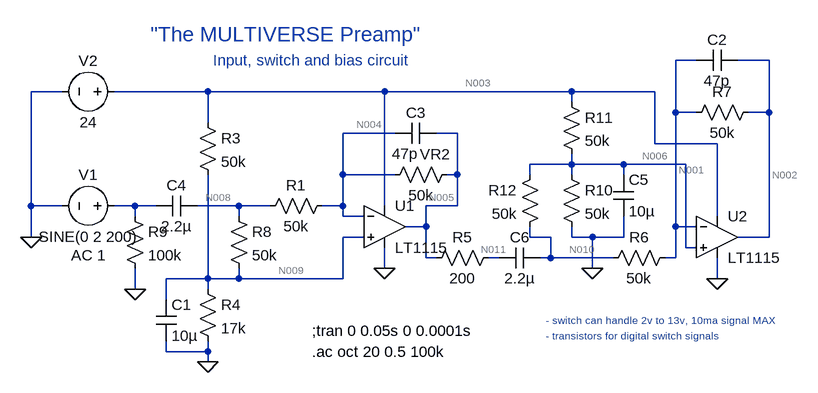
[diagram p0: schematic Input Bias Circuit.asc]
Input Bias Circuit.asc, the LTspice schematic file:
Version 4
SHEET 1 880 680
WIRE 528 -96 496 -96
WIRE 640 -96 592 -96
WIRE -448 -48 -496 -48
WIRE -224 -48 -368 -48
WIRE 48 -48 -224 -48
WIRE 336 -48 48 -48
WIRE 464 -48 336 -48
WIRE 336 -32 336 -48
WIRE 496 -16 496 -96
WIRE 528 -16 496 -16
WIRE 640 -16 640 -96
WIRE 640 -16 608 -16
WIRE -224 0 -224 -48
WIRE 64 16 -16 16
WIRE 160 16 128 16
WIRE 464 32 464 -48
WIRE 560 32 464 32
WIRE 336 64 336 48
WIRE 336 64 272 64
WIRE 416 64 336 64
WIRE 512 64 416 64
WIRE -16 80 -16 16
WIRE 64 80 -16 80
WIRE 160 80 160 16
WIRE 160 80 144 80
WIRE 272 80 272 64
WIRE 336 80 336 64
WIRE 416 80 416 64
WIRE -496 128 -496 -48
WIRE -448 128 -496 128
WIRE -336 128 -368 128
WIRE -304 128 -336 128
WIRE -176 128 -240 128
WIRE -128 128 -176 128
WIRE -16 128 -16 80
WIRE -16 128 -48 128
WIRE 48 128 48 -48
WIRE 160 128 160 80
WIRE 160 128 112 128
WIRE -336 144 -336 128
WIRE -176 144 -176 128
WIRE -16 144 -16 128
WIRE 16 144 -16 144
WIRE 560 144 560 32
WIRE 112 160 112 128
WIRE 112 160 80 160
WIRE 496 160 496 -16
WIRE 528 160 496 160
WIRE -496 176 -496 128
WIRE 16 176 -16 176
WIRE 272 176 272 160
WIRE 304 176 272 176
WIRE 336 176 336 160
WIRE 368 176 336 176
WIRE 416 176 416 144
WIRE 416 176 368 176
WIRE 640 176 640 -16
WIRE 640 176 592 176
WIRE 512 192 512 64
WIRE 528 192 512 192
WIRE 112 208 112 160
WIRE 128 208 112 208
WIRE 224 208 208 208
WIRE 304 208 304 176
WIRE 304 208 288 208
WIRE 400 208 304 208
WIRE 496 208 496 160
WIRE 496 208 480 208
WIRE 48 224 48 192
WIRE 368 224 368 176
WIRE -224 240 -224 80
WIRE -224 240 -288 240
WIRE -176 240 -176 224
WIRE -176 240 -224 240
WIRE -16 240 -16 176
WIRE -16 240 -176 240
WIRE 560 240 560 208
WIRE -336 256 -336 224
WIRE -224 256 -224 240
WIRE -288 272 -288 240
WIRE -288 352 -288 336
WIRE -224 352 -224 336
WIRE -224 352 -288 352
WIRE -224 368 -224 352
FLAG -496 176 0
FLAG -224 368 0
FLAG 48 224 0
FLAG 560 240 0
FLAG -336 256 0
FLAG 368 224 0
SYMBOL voltage -352 128 R90
WINDOW 0 -32 56 VBottom 2
WINDOW 3 32 56 VTop 2
WINDOW 123 60 56 VTop 2
WINDOW 39 0 0 Left 2
SYMATTR InstName V1
SYMATTR Value SINE(0 2 200)
SYMATTR Value2 AC 1
SYMBOL res -32 112 R90
WINDOW 0 0 56 VBottom 2
WINDOW 3 32 56 VTop 2
SYMATTR InstName R1
SYMATTR Value 50k
SYMBOL res 160 64 R90
WINDOW 0 0 34 VBottom 2
WINDOW 3 32 56 VTop 2
SYMATTR InstName VR2
SYMATTR Value 50k
SYMBOL Opamps\\LT1115 48 96 R0
SYMATTR InstName U1
SYMBOL voltage -352 -48 R90
WINDOW 0 -32 56 VBottom 2
WINDOW 3 32 56 VTop 2
WINDOW 123 0 0 Left 2
WINDOW 39 0 0 Left 2
SYMATTR InstName V2
SYMATTR Value 24
SYMBOL res -240 -16 R0
SYMATTR InstName R3
SYMATTR Value 50k
SYMBOL res -240 240 R0
SYMATTR InstName R4
SYMATTR Value 17k
SYMBOL cap -304 272 R0
SYMATTR InstName C1
SYMATTR Value 10µ
SYMBOL res 224 192 R90
WINDOW 0 0 56 VBottom 2
WINDOW 3 32 56 VTop 2
SYMATTR InstName R5
SYMATTR Value 200
SYMBOL Opamps\\LT1115 560 112 R0
SYMATTR InstName U2
SYMBOL res 496 192 R90
WINDOW 0 0 56 VBottom 2
WINDOW 3 32 56 VTop 2
SYMATTR InstName R6
SYMATTR Value 50k
SYMBOL res 624 -32 R90
WINDOW 0 0 56 VBottom 2
WINDOW 3 32 56 VTop 2
SYMATTR InstName R7
SYMATTR Value 50k
SYMBOL cap 592 -112 R90
WINDOW 0 0 32 VBottom 2
WINDOW 3 32 32 VTop 2
SYMATTR InstName C2
SYMATTR Value 47p
SYMBOL res -192 128 R0
SYMATTR InstName R8
SYMATTR Value 50k
SYMBOL cap 128 0 R90
WINDOW 0 0 32 VBottom 2
WINDOW 3 32 48 VTop 2
SYMATTR InstName C3
SYMATTR Value 47p
SYMBOL res -352 128 R0
SYMATTR InstName R9
SYMATTR Value 100k
SYMBOL cap -304 144 R270
WINDOW 0 32 32 VTop 2
WINDOW 3 0 32 VBottom 2
SYMATTR InstName C4
SYMATTR Value 2.2µ
SYMBOL res 320 64 R0
SYMATTR InstName R10
SYMATTR Value 50k
SYMBOL res 320 -48 R0
SYMATTR InstName R11
SYMATTR Value 50k
SYMBOL cap 400 80 R0
SYMATTR InstName C5
SYMATTR Value 10µ
SYMBOL res 288 64 M0
SYMATTR InstName R12
SYMATTR Value 50k
SYMBOL cap 288 192 R90
WINDOW 0 0 32 VBottom 2
WINDOW 3 32 32 VTop 2
SYMATTR InstName C6
SYMATTR Value 2.2µ
TEXT -64 320 Left 2 !;tran 0 0.05s 0 0.0001s
TEXT 296 328 Left 1 ;- transistors for digital switch signals
TEXT 296 304 Left 1 ;- switch can handle 2v to 13v, 10ma signal MAX
TEXT -64 352 Left 2 !.ac oct 20 0.5 100k
TEXT -312 -136 Left 3 ;"The MULTIVERSE Preamp"
TEXT -216 -96 Left 2 ;Input, switch and bias circuit

The netlist it stands for:
* Input Bias Circuit.asc
V1 N007 0 SINE(0 2 200) AC 1
R1 N004 N008 50k
R§VR2 N005 N004 50k
XU1 N009 N004 N003 0 N005 LT1028  ; LT1115, pins In+ In- V+ V- OUT
V2 N003 0 24
R3 N003 N009 50k
R4 N009 0 17k
C1 N009 0 10µ
R5 N011 N005 200
XU2 N006 N001 N003 0 N002 LT1028  ; LT1115, pins In+ In- V+ V- OUT
R6 N001 N010 50k
R7 N002 N001 50k
C2 N002 N001 47p
R8 N008 N009 50k
C3 N005 N004 47p
R9 N007 0 100k
C4 N007 N008 2.2µ
R10 N006 0 50k
R11 N003 N006 50k
C5 N006 0 10µ
R12 N006 N010 50k
C6 N010 N011 2.2µ
;tran 0 0.05s 0 0.0001s
* - transistors for digital switch signals
* - switch can handle 2v to 13v, 10ma signal MAX
.ac oct 20 0.5 100k
* "The MULTIVERSE Preamp"
* Input, switch and bias circuit
.lib LTC.lib
.backanno
.end

* Results of the author's LTspice run, read from the files saved beside the schematic
* Operating Point, zero values left out:
*   V(n004) = 6.09 V
*   V(n008) = 6.09 V
*   V(n005) = 6.089 V
*   V(n009) = 6.09 V
*   V(n003) = 24 V
*   V(n011) = 6.089 V
*   V(n001) = 12 V
*   V(n006) = 12 V
*   V(n002) = 12 V
*   V(n010) = 12 V
*   I(R11) = 240 µA
*   I(R10) = 240 µA
*   I(R8) = 1.967 pA
*   I(R7) = -1.143 pA
*   I(R4) = 358.2 µA
*   I(R3) = 358.2 µA
*   I(Vr2) = -9.839 nA
*   I(R1) = 1.967 pA
*   I(V2) = -15.38 mA
*   Ix(u1:1) = -9.86 nA
*   Ix(u1:2) = -9.841 nA
*   Ix(u1:3) = 7.391 mA
*   Ix(u1:4) = -7.391 mA
*   Ix(u1:5) = 9.851 nA
*   Ix(u2:3) = 7.391 mA
*   Ix(u2:4) = -7.391 mA
*   Ix(u2:5) = 1.143 pA
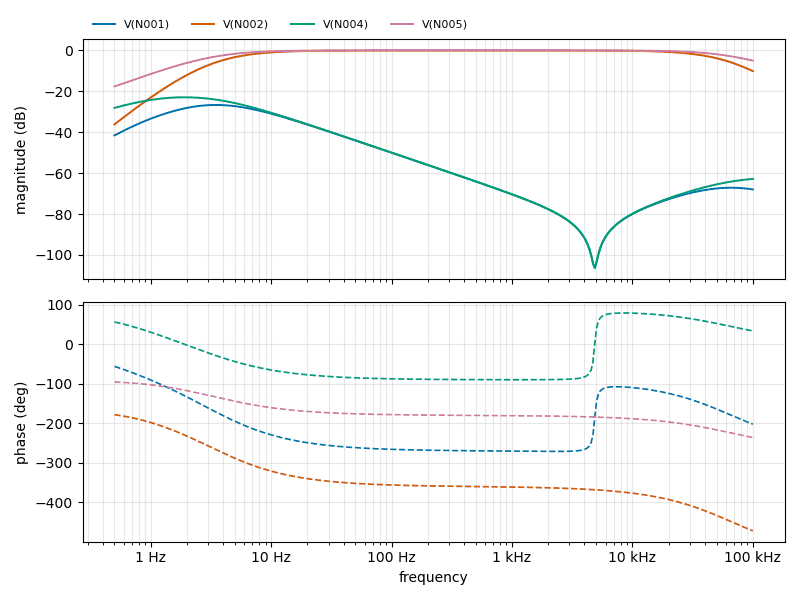
[diagram p1: AC Analysis of Input Bias Circuit.asc, plotted from the saved traces]
* AC Analysis, 1 run:
*   V(N001): -41.57 dB at 500 mHz, -67.96 dB at 100 kHz, peak -26.69 dB at 3.482 Hz, 3 dB below the peak at 1.545 Hz and 8.265 Hz
*   V(N002): -36.17 dB at 500 mHz, -10.15 dB at 100 kHz, peak -0.07 dB at 477.7 Hz, 3 dB below the peak at 5.251 Hz and 43.47 kHz
*   V(N004): -28.12 dB at 500 mHz, -62.83 dB at 100 kHz, peak -22.94 dB at 1.932 Hz, 3 dB below the peak at 702.3 mHz and 5.169 Hz
*   V(N005): -17.66 dB at 500 mHz, -5.04 dB at 100 kHz, peak -0.00 dB at 477.7 Hz, 3 dB below the peak at 3.469 Hz and 67.54 kHz